# Altium project pianoshield.PrjPcb
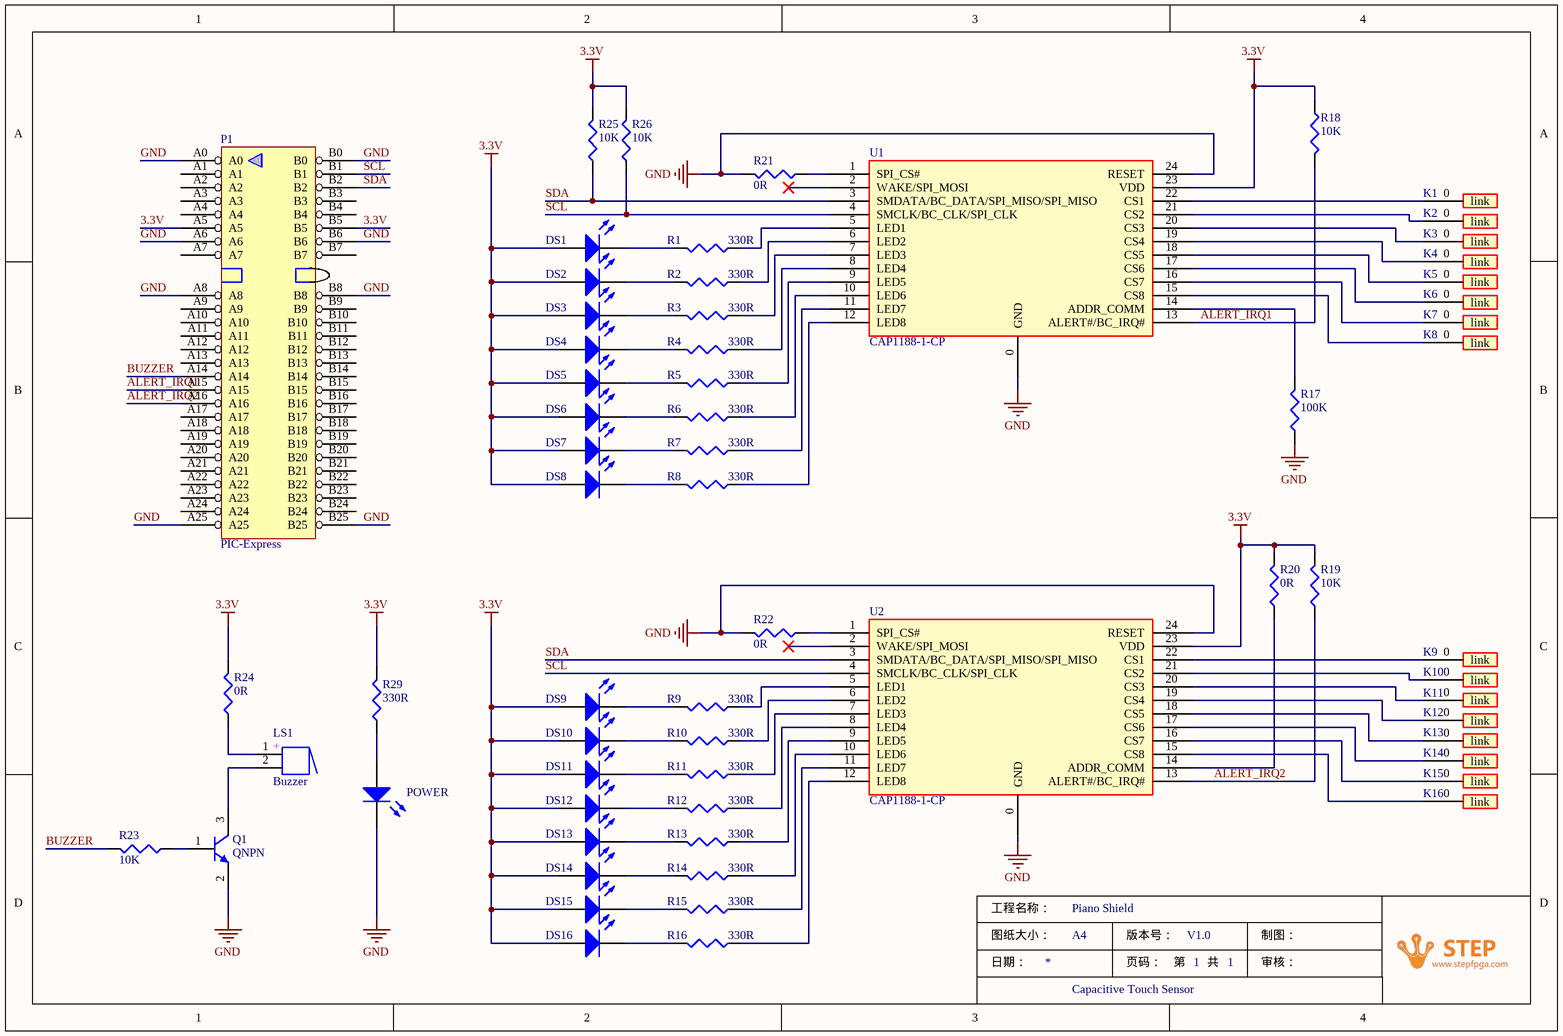
[diagram p0: Pianoshield.SchDoc]
1 sheet, 65 parts. Net scope: global (net labels, ports and power ports of the same name join across sheets).
Board file: Pianoshield.PcbDoc

## Sheet Pianoshield.SchDoc: Piano Shield
size A4; Revision: V1.0; SheetNumber: 1; SheetTotal: 1; Function: Capacitive Touch Sensor

### Parts
DS1  Blue  [LED0603]  (value not drawn)
DS2  Blue  [LED0603]  (value not drawn)
DS3  Blue  [LED0603]  (value not drawn)
DS4  Blue  [LED0603]  (value not drawn)
DS5  Blue  [LED0603]  (value not drawn)
DS6  Blue  [LED0603]  (value not drawn)
DS7  Blue  [LED0603]  (value not drawn)
DS8  Blue  [LED0603]  (value not drawn)
DS9  Blue  [LED0603]  (value not drawn)
DS10  Blue  [LED0603]  (value not drawn)
DS11  Blue  [LED0603]  (value not drawn)
DS12  Blue  [LED0603]  (value not drawn)
DS13  Blue  [LED0603]  (value not drawn)
DS14  Blue  [LED0603]  (value not drawn)
DS15  Blue  [LED0603]  (value not drawn)
DS16  Blue  [LED0603]  (value not drawn)
K1  Keypad_1  [触摸按键5mm*7mm]  (value not drawn)
K2  Keypad_1  [触摸按键5mm*7mm]  (value not drawn)
K3  Keypad_1  [触摸按键5mm*7mm]  (value not drawn)
K4  Keypad_1  [触摸按键5mm*7mm]  (value not drawn)
K5  Keypad_1  [触摸按键5mm*7mm]  (value not drawn)
K6  Keypad_1  [触摸按键5mm*7mm]  (value not drawn)
K7  Keypad_1  [触摸按键5mm*7mm]  (value not drawn)
K8  Keypad_1  [触摸按键5mm*7mm]  (value not drawn)
K9  Keypad_1  [触摸按键5mm*7mm]  (value not drawn)
K10  Keypad_1  [触摸按键5mm*7mm]  (value not drawn)
K11  Keypad_1  [触摸按键5mm*7mm]  (value not drawn)
K12  Keypad_1  [触摸按键5mm*7mm]  (value not drawn)
K13  Keypad_1  [触摸按键5mm*7mm]  (value not drawn)
K14  Keypad_1  [触摸按键5mm*7mm]  (value not drawn)
K15  Keypad_1  [触摸按键5mm*7mm]  (value not drawn)
K16  Keypad_1  [触摸按键5mm*7mm]  (value not drawn)
LS1  Buzzer  [BEEPER]
P1  PIC-Express  [PICE-M]
POWER  Green  [LED0603]  (value not drawn)
Q1  QNPN  [SOT-23-3]
R1  330R  [R0201]
R2  330R  [R0201]
R3  330R  [R0201]
R4  330R  [R0201]
R5  330R  [R0201]
R6  330R  [R0201]
R7  330R  [R0201]
R8  330R  [R0201]
R9  330R  [R0201]
R10  330R  [R0201]
R11  330R  [R0201]
R12  330R  [R0201]
R13  330R  [R0201]
R14  330R  [R0201]
R15  330R  [R0201]
R16  330R  [R0201]
R17  100K  [R0201]
R18  10K  [R0201]
R19  10K  [R0201]
R20  0R  [R0201]
R21  0R  [R0201]
R22  0R  [R0201]
R23  10K  [R0201]
R24  0R  [R0201]
R25  10K  [R0201]
R26  10K  [R0201]
R29  330R  [R0201]
U1  CAP1188-1-CP  [QFN24]
U2  CAP1188-1-CP  [QFN24]

### Nets
3.3V: DS1.1(A) DS2.1(A) DS3.1(A) DS4.1(A) DS5.1(A) DS6.1(A) DS7.1(A) DS8.1(A) DS9.1(A) DS10.1(A) DS11.1(A) DS12.1(A) DS13.1(A) DS14.1(A) DS15.1(A) DS16.1(A) P1.A5 P1.B5 R18.1 R19.2 R20.2 R24.2 R25.2 R26.2 R29.2 U1.23(VDD) U2.23(VDD)
GND: P1.A0 P1.A6 P1.A8 P1.A25 P1.B0 P1.B6 P1.B8 P1.B25 POWER.2(K) Q1.2(E) R17.1 R21.2 R22.2 U1.0(GND) U1.24(RESET) U2.0(GND) U2.24(RESET)
ALERT_IRQ1: P1.A15 R18.2 U1.13(ALERT#/BC_IRQ#)
ALERT_IRQ2: P1.A16 R19.1 U2.13(ALERT#/BC_IRQ#)
BUZZER: P1.A14 R23.2
SCL: P1.B1 R26.1 U1.4(SMCLK/BC_CLK/SPI_CLK) U2.4(SMCLK/BC_CLK/SPI_CLK)
SDA: P1.B2 R25.1 U1.3(SMDATA/BC_DATA/SPI_MISO/SPI_MISO) U2.3(SMDATA/BC_DATA/SPI_MISO/SPI_MISO)
NetDS1_2: DS1.2(K) R1.2
NetDS2_2: DS2.2(K) R2.2
NetDS3_2: DS3.2(K) R3.2
NetDS4_2: DS4.2(K) R4.2
NetDS5_2: DS5.2(K) R5.2
NetDS6_2: DS6.2(K) R6.2
NetDS7_2: DS7.2(K) R7.2
NetDS8_2: DS8.2(K) R8.2
NetDS9_2: DS9.2(K) R9.2
NetDS10_2: DS10.2(K) R10.2
NetDS11_2: DS11.2(K) R11.2
NetDS12_2: DS12.2(K) R12.2
NetDS13_2: DS13.2(K) R13.2
NetDS14_2: DS14.2(K) R14.2
NetDS15_2: DS15.2(K) R15.2
NetDS16_2: DS16.2(K) R16.2
NetK1_0: K1.0(link) U1.22(CS1)
NetK2_0: K2.0(link) U1.21(CS2)
NetK3_0: K3.0(link) U1.20(CS3)
NetK4_0: K4.0(link) U1.19(CS4)
NetK5_0: K5.0(link) U1.18(CS5)
NetK6_0: K6.0(link) U1.17(CS6)
NetK7_0: K7.0(link) U1.16(CS7)
NetK8_0: K8.0(link) U1.15(CS8)
NetK9_0: K9.0(link) U2.22(CS1)
NetK10_0: K10.0(link) U2.21(CS2)
NetK11_0: K11.0(link) U2.20(CS3)
NetK12_0: K12.0(link) U2.19(CS4)
NetK13_0: K13.0(link) U2.18(CS5)
NetK14_0: K14.0(link) U2.17(CS6)
NetK15_0: K15.0(link) U2.16(CS7)
NetK16_0: K16.0(link) U2.15(CS8)
NetLS1_1: LS1.1 R24.1
NetLS1_2: LS1.2 Q1.3(C)
NetPOWER_1: POWER.1(A) R29.1
NetQ1_1: Q1.1(B) R23.1
NetR1_1: R1.1 U1.5(LED1)
NetR2_1: R2.1 U1.6(LED2)
NetR3_1: R3.1 U1.7(LED3)
NetR4_1: R4.1 U1.8(LED4)
NetR5_1: R5.1 U1.9(LED5)
NetR6_1: R6.1 U1.10(LED6)
NetR7_1: R7.1 U1.11(LED7)
NetR8_1: R8.1 U1.12(LED8)
NetR9_1: R9.1 U2.5(LED1)
NetR10_1: R10.1 U2.6(LED2)
NetR11_1: R11.1 U2.7(LED3)
NetR12_1: R12.1 U2.8(LED4)
NetR13_1: R13.1 U2.9(LED5)
NetR14_1: R14.1 U2.10(LED6)
NetR15_1: R15.1 U2.11(LED7)
NetR16_1: R16.1 U2.12(LED8)
NetR17_2: R17.2 U1.14(ADDR_COMM)
NetR20_1: R20.1 U2.14(ADDR_COMM)
NetR21_1: R21.1 U1.1(SPI_CS#)
NetR22_1: R22.1 U2.1(SPI_CS#)

Not connected (* = marked no-connect by the designer): P1 A1 A2 A3 A4 A7 A9 A10 A11 A12 A13 A17 A18 A19 A20 A21 A22 A23 A24 B3 B4 B7 B9 B10 B11 B12 B13 B14 B15 B16 B17 B18 B19 B20 B21 B22 B23 B24; U1 2(WAKE/SPI_MOSI)*; U2 2(WAKE/SPI_MOSI)*

### Notes on the sheet
- 工程名称：
- 图纸大小：
- 日期：
- A4
- 版本号：
- 页码：
- 第
- 共
- 制图：
- 审核：
- (in symbol Buzzer) +

### Library data of the parts
DS1-DS16 POWER = LED2: 贴片LED，0603; Published: 8-Jun-2000; LatestRevisionDate: 17-Jul-2002; LatestRevisionNote: Re-released for DXP Platform.; PackageDocument: Feb-2002; PackageReference: 3.2X1.6X1.1; Publisher: Altium Limited
  DS1-DS16: Value: Blue
  POWER: Value: Green
LS1 = Buzzer: Magnetic Transducer Buzzer; Published: 24-Mar-1999; LatestRevisionDate: 17-Dec-2003; LatestRevisionNote: Schematic revised, PCB Footprint replaced.; DatasheetVersion: 17-Dec-2003; PackageReference: ABSM-1574; Publisher: Altium Limited; PackageDescription: Magnetic Transducer Buzzer; ComponentLink1Description: Manufacturer Link; ComponentLink1URL: http://www.megastar.com/linecard/buzzmode/index.php; Value: Buzzer
Q1 = QNPN: NPN Bipolar Transistor; Published: 8-Jun-2000; LatestRevisionDate: 29-May-2009; LatestRevisionNote: IPC-7351 Footprint Added.; PackageVersion: Aug-1999; PackageReference: SOT-23B; Publisher: Altium Limited; PackageDescription: 3-Pin SOT-23 Package 0.95 mm Pitch, 2.4 mm Lead Span
R1-R26 R29 = Res: Resistor; Published: 8-Jun-2000; LatestRevisionDate: 29-May-2009; LatestRevisionNote: IPC-7351 Footprint Added.; PackageReference: J1-0603; Publisher: Altium Limited; PackageDescription: Chip Resistor
  R1-R16 R29: Value: 330R
  R17: Value: 100K
  R18 R19 R23 R25 R26: Value: 10K
  R20-R22 R24: Value: 0R
U1 U2 = CAP1188: 8通道电容式触摸传感，QFN24; Value: CAP1188-1-CP
P1 = PIC-Express: Pins: 52; Value: PIC-Express